# Altium schematic sheet SecondDriver.SchDoc
size A; SheetNumber: 3; SheetTotal: 3
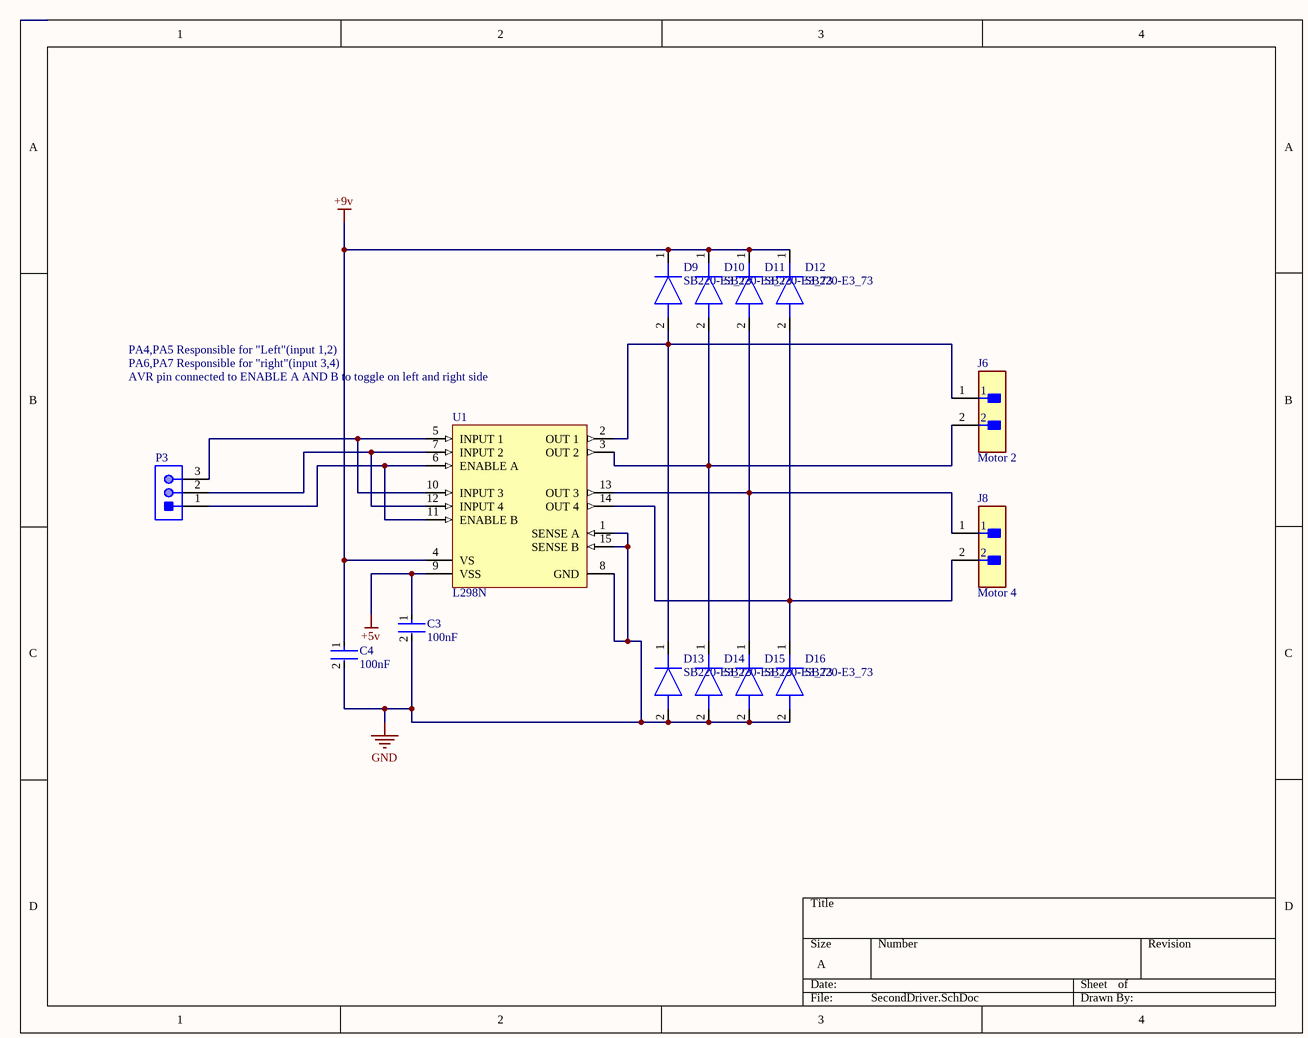
[diagram p0: SecondDriver.SchDoc]

## Parts
C3  100nF  [FP-K15H5-MFG]
C4  100nF  [FP-K15H5-MFG]
D9  SB220-E3_73  [DIOAD1910W86L670D310]
D10  SB220-E3_73  [DIOAD1910W86L670D310]
D11  SB220-E3_73  [DIOAD1910W86L670D310]
D12  SB220-E3_73  [DIOAD1910W86L670D310]
D13  SB220-E3_73  [DIOAD1910W86L670D310]
D14  SB220-E3_73  [DIOAD1910W86L670D310]
D15  SB220-E3_73  [DIOAD1910W86L670D310]
D16  SB220-E3_73  [DIOAD1910W86L670D310]
J6  Motor 2  [FP-M20-9990246-MFG]
J8  Motor 4  [FP-M20-9990246-MFG]
P3  (no value)  [MOLX-22-28-4033_V]
U1  L298N  [STM-FM-15]

## Nets
+5v: C3.1 U1.9(VSS)
+9v: C4.1 D9.1(K) D10.1(K) D11.1(K) D12.1(K) U1.4(VS)
GND: C3.2 C4.2 D13.2(A) D14.2(A) D15.2(A) D16.2(A) U1.1(SENSE_A) U1.8(GND) U1.15(SENSE_B)
NetD9_2: D9.2(A) D13.1(K) J6.1 U1.2(OUT_1)
NetD10_2: D10.2(A) D14.1(K) J6.2 U1.3(OUT_2)
NetD11_2: D11.2(A) D15.1(K) J8.1 U1.13(OUT_3)
NetD12_2: D12.2(A) D16.1(K) J8.2 U1.14(OUT_4)
NetP3_1: P3.1 U1.6(ENABLE_A) U1.11(ENABLE_B)
NetP3_2: P3.2 U1.7(INPUT_2) U1.12(INPUT_4)
NetP3_3: P3.3 U1.5(INPUT_1) U1.10(INPUT_3)

## Notes on the sheet
- PA4,PA5 Responsible for "Left"(input 1,2)
- PA6,PA7 Responsible for "right"(input 3,4)
- AVR pin connected to ENABLE A AND B to toggle on left and right side

## Library data of the parts
C3 C4 = CMP-02417-000078-1: CAP CER 0.1UF 50V X7R RADIAL; Tolerance: 10%; Dielectric Material: Ceramic; Lead Length: 30mm; Lead Diameter: 0.5mm; Lead/Base Style: Formed Leads; Capacitance: 100nF; Diameter: 500um; Max Operating Temperature: 125°C; Case/Package: Dipped; Dielectric: X7R; Lead Free: Lead Free; Construction: RADIAL; Voltage: 50V; Thickness: 2.6mm; Min Operating Temperature: -55°C; Lead Pitch: 5mm; Height: 4mm; Radiation Hardening: No; Voltage Rating: 50V; Depth: 2.5mm; Voltage Rating (DC): 50V; Package Quantity: 1; Weight: 0.005644oz; Series: K; Mount: Through Hole; Termination: Radial; Height - Seated (Max): 0.257inch; Length: 4mm; Packaging: Tape and Reel; Width: 2.5mm; RoHS Compliant: Yes
D9-D16 = SB220-E3_73: Diode; Manufacturer_Name: Vishay; Manufacturer_Part_Number: SB220-E3/73; Datasheet Link: http://www.vishay.com/docs/88717/sb220.pdf; Mouser Part Number: 625-SB220-E3/73; Mouser Price/Stock: https://www.mouser.co.uk/ProductDetail/Vishay-General-Semiconductor/SB220-E3-73?qs=u91jd7aysvPbXL6e9uzQKg%3D%3D
J6 J8 = CMP-15831-000009-1: CONN HEADER VERT 2POS 2.54MM; Manufacturer: Harwin; Manufacturer Part Number: M20-9990246; Conn Gender: Male; Conn Orientation: Vertical; Number Of Contacts: 2; Current Rating: 3A; ComponentLink2URL: https://cdn.harwin.com/pdfs/M20-999.pdf; ComponentLink2Description: Datasheet; Package: M20-9990246; Temperature: -40°C to +105°C; Octopart: https://octopart.com/m20-9990246-harwin-2590635; Mouser Description: 2.54mm (0.1") Pitch SIL Vertical PC Tail Pin Header, 6.1mm mating pin height, tin, 2 contacts; Temperature Range High: +105°C; Device Class L1: Connectors; RoHS: TRUE; Automotive: No; Height: 8.99mm; Number Of Rows: 1; Contact Material: Tin,Nickel; Category: Conn; Pitch: 2.54mm; Lead Free: Yes; Digikey Description: CONN HEADER VERT 2POS 2.54MM; Temperature Range Low: -40°C; Device Class L3: unset; Device Class L2: Headers and Wire Housings
P3 = CMP-1676-00001-5: Male Header, Pitch 2.54 mm, 1 x 3 Position, Height 8.38 mm, Tail Length 3.18 mm, RoHS, Bulk; Manufacturer: Molex; Rows: 1; Voltage Rating: 250 V; Current Rating: 4 A; Min Operating Temperature: 0 degC; Lead Pitch: 0.1 inch; Packaging: Bulk; Contact Finish: Gold; RoHSCompliant: true; Contact Material: Brass; PackageReference: 22-28-4033; REACH SVHC: Unknown; PackageDescription: Male Header, Pitch 2.54 mm, 1 x 3 Position, Height 8.38 mm, Tail Length 3.18 mm; ComponentLink2URL: http://www.molex.com/pdm_docs/sd/022284033_sd.pdf; Height: 8.38 mm; Mounting Technology: Through Hole; ComponentLink1Description: Manufacturer URL; Length: 7.62 mm; Mount: Through Hole; DatasheetVersion: Rev. G, 01/2012; Max Operating Temperature: 75 degC; ComponentLink2Description: Datasheet; Colour: Black; Pins: 3; Contact Plating: Gold; Package Quantity: 1; ComponentLink1URL: http://www.molex.com/
U1 = CMP-2000-06526-1: Dual Full-Bridge Driver, 4.8 to 46 V, -40 to 150 degC, 15-Pin FM (MW 15L), RoHS, Tube; Manufacturer: STMicroelectronics; PartNumber: L298; Output Current: 2A; Supply Voltage Max: 7V; Driver Case Style: Multiwatt; Supply Voltage Min: 4.5V; No. of Pins: 15Pins; SVHC: NoSVHC(17-Dec-2015); Output Voltage: 46V; No. of Outputs: 4Outputs; Motor Type: FullBridge; MSL: -; Package Description: 15-Pin Flange Mount, Body 5 x 19.6 mm, Pitch 1.27 mm; Datasheet Version: 01/2000; Package Reference: FM-15; Mounting Technology: ThroughHole; Packaging: Each; Automotive Qualification Standard: -; Product Range: -; Datasheet URL: https://datasheet.ciiva.com/15109/getdatasheetpartid-50682-15109332.pdf; Operating Temperature Max: 130°C; Operating Temperature Min: -25°C; Manufacturer URL: http://www.st.com/